# EAGLE schematic P1 (EAGLE 7.1.0)
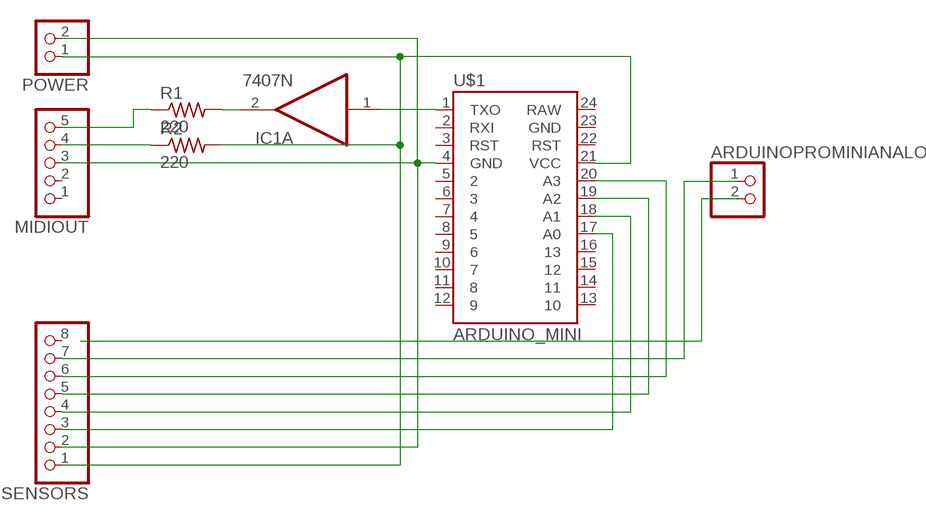
[diagram p0: schematic, sheet 1]

## Parts
ARDUINOPROMINIANALOG  PINHD-1X2  [1X02]
IC1  7407N  [DIL14]
MIDIOUT  PINHD-1X5  [1X05]
POWER  PINHD-1X2  [1X02]
R1  220  R-US_0204/5  [0204/5]
R2  220  R-US_0204/5  [0204/5]
SENSORS  PINHD-1X8  [1X08]
U$1  ARDUINO_MINI  [ARDUINO_MINI]

## Nets
N$1: IC1.1(A:I) U$1.1(TXO)
N$2: IC1.2(A:O) R1.2
N$3: POWER.1 R2.2 SENSORS.1 U$1.21(VCC)
N$4: MIDIOUT.4 R2.1
N$5: MIDIOUT.5 R1.1
N$6: MIDIOUT.3 POWER.2 SENSORS.2 U$1.4(GND)
N$7: SENSORS.3 U$1.17(A0)
N$8: SENSORS.4 U$1.18(A1)
N$9: SENSORS.5 U$1.19(A2)
N$10: SENSORS.6 U$1.20(A3)
N$11: ARDUINOPROMINIANALOG.1 SENSORS.7
N$12: ARDUINOPROMINIANALOG.2
Unconnected: IC1.3(B:I) IC1.4(B:O) IC1.5(C:I) IC1.6(C:O) IC1.8(D:O) IC1.9(D:I) IC1.10(E:O) IC1.11(E:I) IC1.12(F:O) IC1.13(F:I) MIDIOUT.1 MIDIOUT.2 SENSORS.8 U$1.2(RXI) U$1.3(RST) U$1.5 U$1.6 U$1.7 U$1.8 U$1.9 U$1.10 U$1.11 U$1.12 U$1.13 U$1.14 U$1.15 U$1.16 U$1.22(RST) U$1.23(GND) U$1.24(RAW)

## Power pins joined to a net without a drawn wire
GND: IC1.7(P:GND)
VCC: IC1.14(P:VCC)

## Library data of the parts
ARDUINOPROMINIANALOG POWER = pinhead:PINHD-1X2: PIN HEADER
IC1 = 74xx-us:74*07: Hex BUFFER, open collector high-voltage output
MIDIOUT = pinhead:PINHD-1X5: PIN HEADER
R1 R2 = resistor:R-US_: RESISTOR, American symbol
SENSORS = pinhead:PINHD-1X8: PIN HEADER
U$1 = SparkFun-Boards:ARDUINO_MINI: Arduino Pro Mini footprint